# EAGLE schematic Pi-Matic.-.v0.2 (EAGLE 6.5.0)
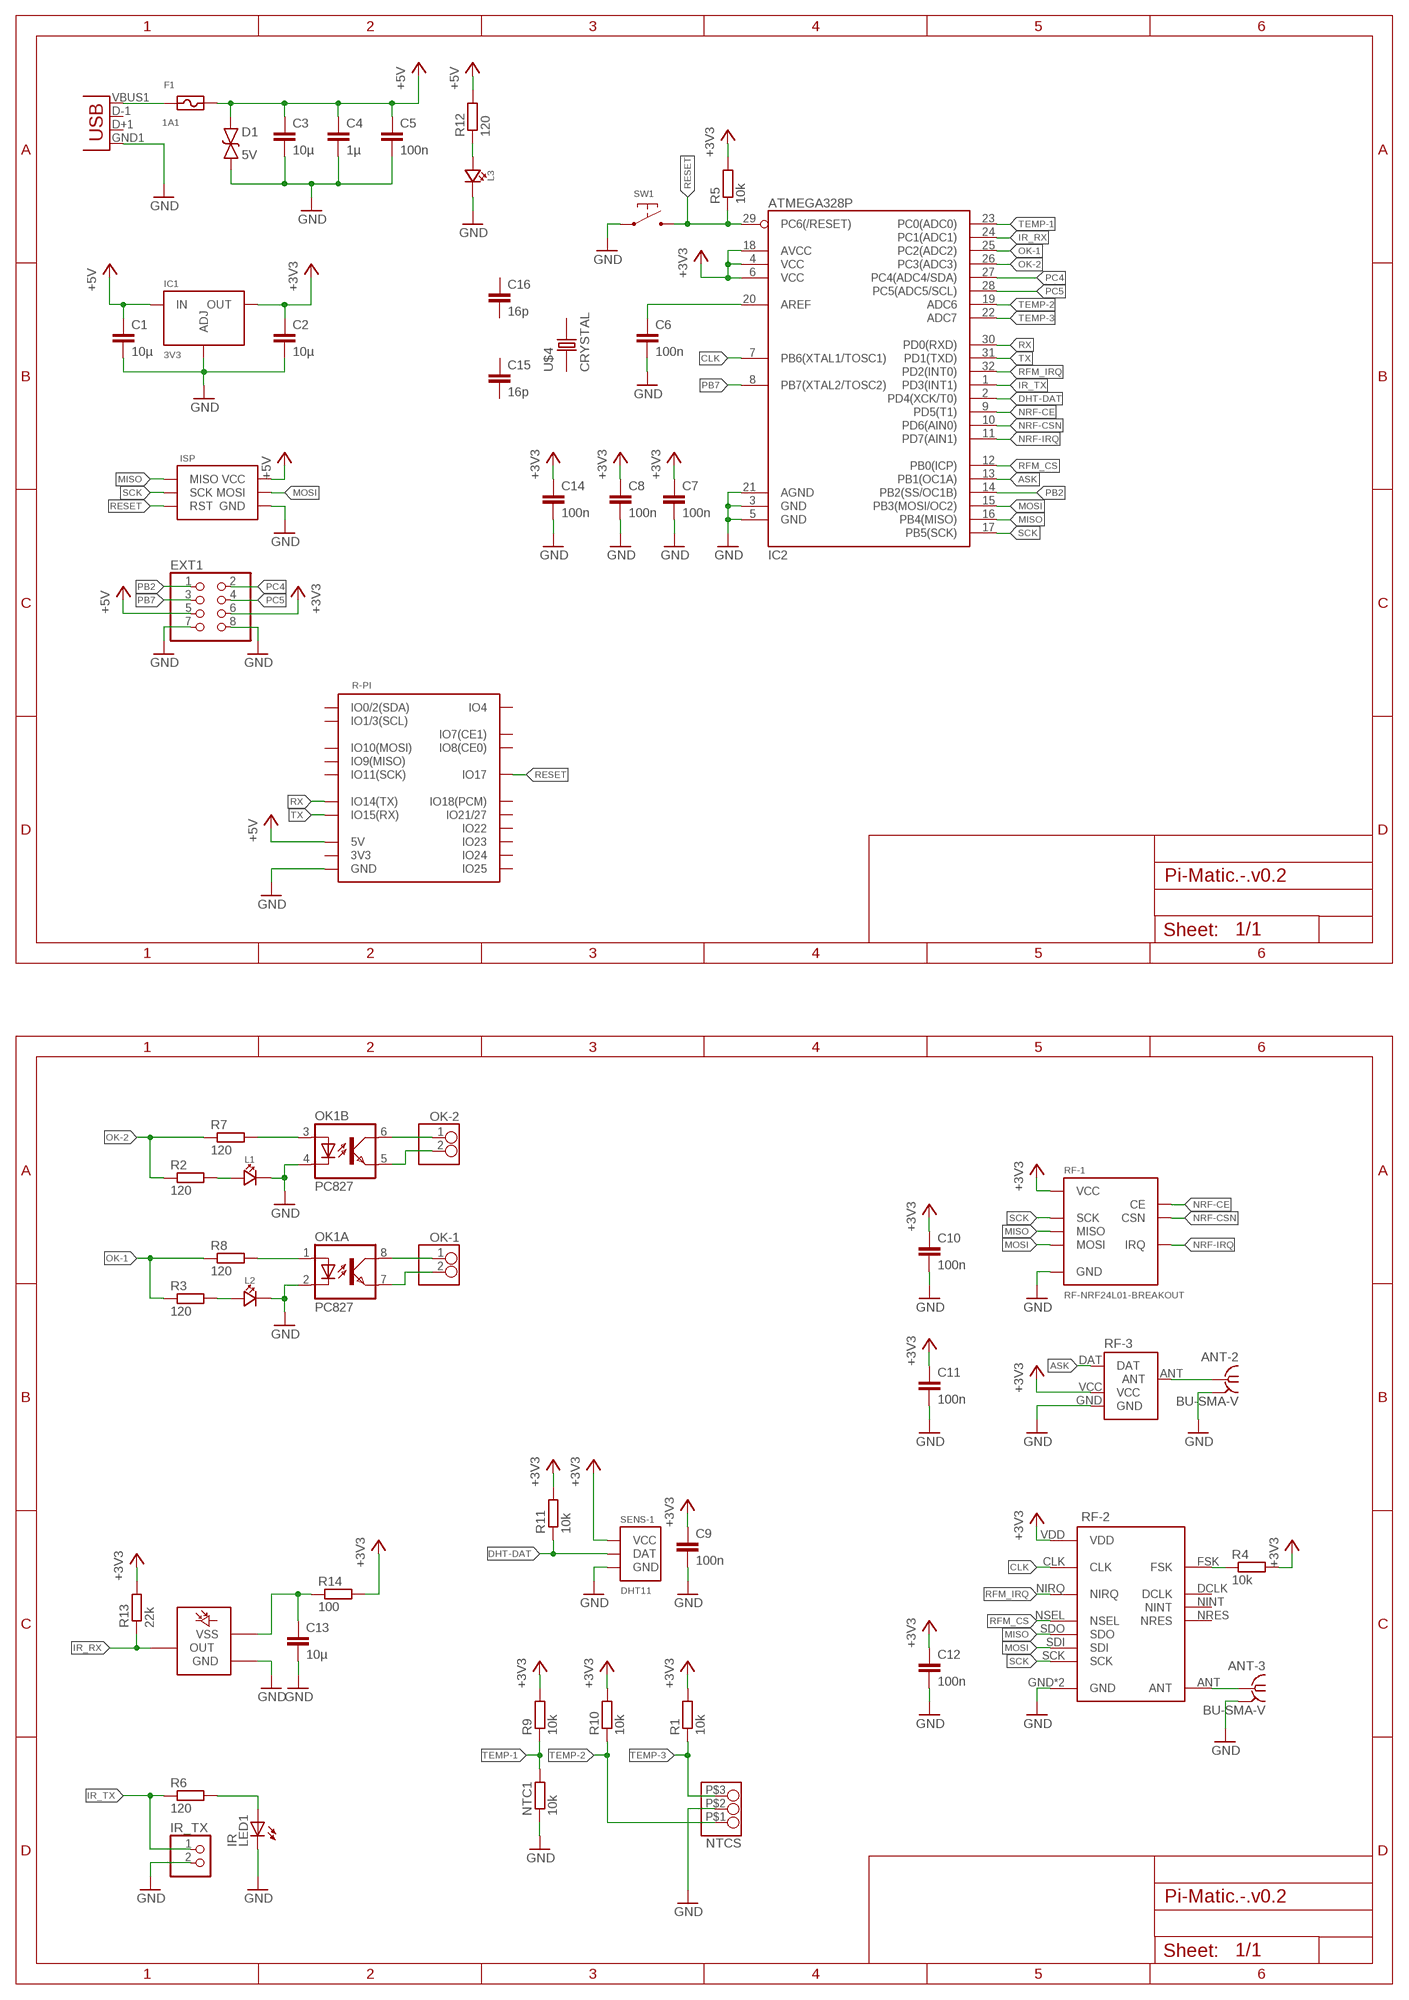
[diagram p0: schematic, sheet 1]

## Parts
ANT-2  BU-SMA-V  [BU-SMA-V]
ANT-3  BU-SMA-V  [BU-SMA-V]
C1  10µ  C-EUC0805  [C0805]
C2  10µ  C-EUC0805  [C0805]
C3  10µ  C-EUC0805  [C0805]
C4  1µ  C-EUC0805  [C0805]
C5  100n  C-EUC0603  [C0603]
C6  100n  C-EUC0603  [C0603]
C7  100n  C-EUC0603  [C0603]
C8  100n  C-EUC0603  [C0603]
C9  100n  C-EUC0603  [C0603]
C10  100n  C-EUC0603  [C0603]
C11  100n  C-EUC0603  [C0603]
C12  100n  C-EUC0603  [C0603]
C13  10µ  C-EUC0805  [C0805]
C14  100n  C-EUC0603  [C0603]
C15  16p  C-EUC0603  [C0603]
C16  16p  C-EUC0603  [C0603]
D1  5V  DIODE-TVS-BI  [R0603]
EXT1  PINHD-2X4  [2X04]
F1  1A1  FUSE1812  [SMD-1812]
IC1  3V3  REGULATOR-TLV1117SOT223  [SOT223]
IC2  ATMEGA328P  ATMEGA328_SMT  [TQFP32-08]
IR_TX  PINHD-1X2/90  [1X02/90]
ISP  ISP-6_PIN-NORMAL  [PINHEADER-100-MIL-2X6-ISP]
L1  LED0603  [CHIPLED_0603]
L2  LED0603  [CHIPLED_0603]
L3  LED0603  [CHIPLED_0603]
LED1  IR  LED5MM  [LED5MM]
NTC1  10k  R-EU_R0805  [R0805]
NTCS  GENERIC-1X3WAGO-5MM  [WAGO-5MM-3_PIN]
OK1  PC827  OPTOCOUPLER-PC827SMD  [SMD08]
OK-1  GENERIC-1X2_PINWAGO-5MM-N  [WAGO-5MM-2_PIN-1]
OK-2  GENERIC-1X2_PINWAGO-5MM-N  [WAGO-5MM-2_PIN-1]
R1  10k  R-EU_R0603  [R0603]
R2  120  R-EU_R0603  [R0603]
R3  120  R-EU_R0603  [R0603]
R4  10k  R-EU_R0603  [R0603]
R5  10k  R-EU_R0603  [R0603]
R6  120  R-EU_R0603  [R0603]
R7  120  R-EU_R0603  [R0603]
R8  120  R-EU_R0603  [R0603]
R9  10k  R-EU_R0603  [R0603]
R10  10k  R-EU_R0603  [R0603]
R11  10k  R-EU_R0603  [R0603]
R12  120  R-EU_R0603  [R0603]
R13  22k  R-EU_R0603  [R0603]
R14  100  R-EU_R0603  [R0603]
R-PI  RASPBERRY-PI  [RASPBERRY-PI]
RF-1  RF-NRF24L01-BREAKOUT  [RF-NRF2401]
RF-2  RADIO-RFM12SMD  [RADIO-RFM12-SMD]
RF-3  RADIO-QAM_TX1  [RADIO-ASK-QAM-TX1-SIP]
SENS-1  DHT11  DHT11DHT11  [SENSOR-DHT11]
SW1  SWITCH-DEFAULT_OFF-SMD-2_PIN  [SWITCH-SMD-2_PIN-DX]
U$1  IR-RECIEVERTSOP348XX  [IR-REC-3PIN]
U$3  USB  [USB-AB-MICRO-SMD_V03]
U$4  CRYSTAL  [CRYSTAL-SMD-5MM_X_3.2MM]

## Nets
+3V3: C2.1 C7.1 C8.1 C9.1 C10.1 C11.1 C12.1 C14.1 EXT1.6 IC1.2(OUT) IC1.4(OUT) IC2.4(VCC) IC2.6(VCC) IC2.18(AVCC) R1.2 R4.2 R5.2 R9.2 R10.2 R11.2 R13.2 R14.2 RF-1.P$2(VCC) RF-2.VDD RF-3.VCC SENS-1.P$1(VCC)
+5V: C1.1 C3.1 C4.1 C5.1 D1.1 EXT1.5 F1.P$2 IC1.3(IN) ISP.P$6(VCC) R12.2 R-PI.2(5V) R-PI.4(5V)
ASK: IC2.13(PB1(OC1A)) RF-3.DAT
CLK: IC2.7(PB6(XTAL1/TOSC1)) RF-2.CLK
DHT-DAT: IC2.2(PD4(XCK/T0)) R11.1 SENS-1.P$2(DAT)
GND: ANT-2.2 ANT-2.3 ANT-2.4 ANT-2.5 ANT-3.2 ANT-3.3 ANT-3.4 ANT-3.5 C1.2 C2.2 C3.2 C4.2 C5.2 C6.2 C7.2 C8.2 C9.2 C10.2 C11.2 C12.2 C13.2 C14.2 D1.2 EXT1.7 EXT1.8 IC1.1(ADJ) IC2.3(GND) IC2.5(GND) IC2.21(AGND) IR_TX.2 ISP.P$4(GND) L1.C L2.C L3.C LED1.K(C) NTC1.1 NTCS.P$2 OK1.2(A:C) OK1.4(B:C) R-PI.6(GND) R-PI.9(GND) R-PI.14(GND) R-PI.20(GND) R-PI.25(GND) RF-1.P$1(GND) RF-2.GND RF-2.GND_(GND) RF-3.GND SENS-1.P$4(GND) SW1.P$1 U$1.P$2(GND) U$3.GND1(GND)
IR_RX: IC2.24(PC1(ADC1)) R13.1 U$1.P$1(OUT)
IR_TX: IC2.1(PD3(INT1)) IR_TX.1 R6.1
MISO: IC2.16(PB4(MISO)) ISP.P$1(MISO) RF-1.P$7(MISO) RF-2.SDO
MOSI: IC2.15(PB3(MOSI/OC2)) ISP.P$5(MOSI) RF-1.P$6(MOSI) RF-2.SDI
N$1: ANT-2.1 RF-3.ANT
N$2: ANT-3.1 RF-2.ANT
N$3: LED1.A R6.2
N$4: R4.1 RF-2.FSK
N$5: OK1.1(A:A) R8.2
N$6: OK1.3(B:A) R7.2
N$7: OK1.5(B:EMIT) OK-2.2
N$8: OK1.6(B:COL) OK-2.1
N$9: OK1.8(A:COL) OK-1.1
N$10: OK1.7(A:EMIT) OK-1.2
N$11: L1.A R2.2
N$12: L2.A R3.2
N$13: F1.P$1 U$3.VBUS1(VBUS)
N$14: L3.A R12.1
N$15: C6.1 IC2.20(AREF)
N$16: C13.1 R14.1 U$1.P$3(VSS)
NRF-CE: IC2.9(PD5(T1)) RF-1.P$3(CE)
NRF-CSN: IC2.10(PD6(AIN0)) RF-1.P$4(CSN)
NRF-IRQ: IC2.11(PD7(AIN1)) RF-1.P$8(IRQ)
OK-1: IC2.25(PC2(ADC2)) R3.1 R8.1
OK-2: IC2.26(PC3(ADC3)) R2.1 R7.1
PB2: EXT1.1 IC2.14(PB2(SS/OC1B))
PB7: EXT1.3 IC2.8(PB7(XTAL2/TOSC2))
PC4: EXT1.2 IC2.27(PC4(ADC4/SDA))
PC5: EXT1.4 IC2.28(PC5(ADC5/SCL))
RESET: IC2.29(PC6(/RESET)) ISP.P$3(RST) R5.1 R-PI.11(IO17) SW1.P$2
RFM_CS: IC2.12(PB0(ICP)) RF-2.NSEL
RFM_IRQ: IC2.32(PD2(INT0)) RF-2.NIRQ
RX: IC2.30(PD0(RXD)) R-PI.8(IO14(TX))
SCK: IC2.17(PB5(SCK)) ISP.P$2(SCK) RF-1.P$5(SCK) RF-2.SCK
TEMP-1: IC2.23(PC0(ADC0)) NTC1.2 R9.1
TEMP-2: IC2.19(ADC6) NTCS.P$1 R10.1
TEMP-3: IC2.22(ADC7) NTCS.P$3 R1.1
TX: IC2.31(PD1(TXD)) R-PI.10(IO15(RX))
Unconnected: C15.1 C15.2 C16.1 C16.2 R-PI.1(3V3) R-PI.3(IO0/2(SDA)) R-PI.5(IO1/3(SCL)) R-PI.7(IO4) R-PI.12(IO18(PCM)) R-PI.13(IO21/27) R-PI.15(IO22) R-PI.16(IO23) R-PI.17(3V3) R-PI.18(IO24) R-PI.19(IO10(MOSI)) R-PI.21(IO9(MISO)) R-PI.22(IO25) R-PI.23(IO11(SCK)) R-PI.24(IO8(CE0)) R-PI.26(IO7(CE1)) RF-2.DCLK RF-2.NINT RF-2.NRES U$3.D+1(D+) U$3.D-1(D-) U$4.P$1(C1) U$4.P$2(C2)

## Library data of the parts
ANT-2 ANT-3 = con-coax:BU-SMA-V: FEMALE SMA CONNECTOR Radiall distributor RS 112-3794; OC_FARNELL: unknown; OC_NEWARK: unknown
C1-C16 = p.peter-rcl:C-EU: CAPACITOR, European symbol
D1 = p.peter-passives:DIODE-TVS-BI
EXT1 = pinhead:PINHD-2X4: PIN HEADER
F1 = p.peter-regulators:FUSE
IC1 = p.peter-regulators:REGULATOR-TLV1117
IC2 = SparkFun-DigitalIC:ATMEGA328_SMT: 32-Pin Atmega328 part Commonly used on Arduino compatible boards Available in QFP and QFN packages TQFP is IC-09069 QFN is non-stock; PROD_ID: IC-09069
IR_TX = pinhead:PINHD-1X2: PIN HEADER
ISP = p.peter-connectors:ISP-6_PIN: AVR 6 PIN ISP header Edge connector normal layout
L1-L3 = p.peter-leds:LED
LED1 = led:LED: LED OSRAM: - CHIPLED LG R971, LG N971, LY N971, LG Q971, LY Q971, LO R971, LY R971 LH N974, LH R974 LS Q976, LO Q976, LY Q976 LO Q996 - Hyper CHIPLED LW Q18S LB Q993, LB Q99A, LB R99A - SideLED LS A670, LO A670, LY A670, LG A670, LP A670 LB A673, LV A673, LT A673, LW A673 LH A674 LY A675 LS A676, LA A676, LO A676, LY A676, LW A676 LS A679, LY A679, LG A679 - Hyper Micro SIDELED® LS Y876, LA Y876, LO Y876, LY Y876 LT Y87S - SmartLED LW L88C, LW L88S LB L89C, LB L89S, LG L890 LS L89K, LO L89K, LY L89K LS L896, LA L896, LO L896, LY L896 - TOPLED LS T670, LO T670, LY T670, LG T670, LP T670 LSG T670, LSP T670, LSY T670, LOP T670, LYG T670 LG T671, LOG T671, LSG T671 LB T673, LV T673, LT T673, LW T673 LH T674 LS T676, LA T676, LO T676, LY T676, LB T676, LH T676, LSB T676, LW T676 LB T67C, LV T67C, LT T67C, LS T67K, LO T67K, LY T67K, LW E67C LS E67B, LA E67B, LO E67B, LY E67B, LB E67C, LV E67C, LT E67C LW T67C LS T679, LY T679, LG T679 LS T770, LO T770, LY T770, LG T770, LP T770 LB T773, LV T773, LT T773, LW T773 LH T774 LS E675, LA E675, LY E675, LS T675 LS T776, LA T776, LO T776, LY T776, LB T776 LHGB T686 LT T68C, LB T68C - Hyper Mini TOPLED® LB M676 - Mini TOPLED Santana® LG M470 LS M47K, LO M47K, LY M47K Source: http://www.osram.convergy.de LUXEON: - LUMILED® LXK2-PW12-R00, LXK2-PW12-S00, LXK2-PW14-U00, LXK2-PW14-V00 LXK2-PM12-R00, LXK2-PM12-S00, LXK2-PM14-U00 LXK2-PE12-Q00, LXK2-PE12-R00, LXK2-PE12-S00, LXK2-PE14-T00, LXK2-PE14-U00 LXK2-PB12-K00, LXK2-PB12-L00, LXK2-PB12-M00, LXK2-PB14-N00, LXK2-PB14-P00, LXK2-PB14-Q00 LXK2-PR12-L00, LXK2-PR12-M00, LXK2-PR14-Q00, LXK2-PR14-R00 LXK2-PD12-Q00, LXK2-PD12-R00, LXK2-PD12-S00 LXK2-PH12-R00, LXK2-PH12-S00 LXK2-PL12-P00, LXK2-PL12-Q00, LXK2-PL12-R00 Source: www.luxeon.com KINGBRIGHT: KA-3528ASYC Source: www.kingbright.com
NTC1 R1-R14 = p.peter-rcl:R-EU_: RESISTOR, European symbol
NTCS = p.peter-connectors:GENERIC-1X3
OK1 = p.peter-ics:OPTOCOUPLER-PC827: SHARP OPTO COUPLER
OK-1 OK-2 = p.peter-connectors:GENERIC-1X2_PIN
R-PI = p.peter-periphery:RASPBERRY-PI: Raspberry Pi Board <http://www.raspberrypi.org/> Jacques Lagnel V1.0 (beta) 2012 Board dimension: Forum 3D model <http://www.raspberrypi.org/forum/general-discussion/mechanical-profile-3d-models?value=3d%20model&type=1&include=1&search=1&ret=all> The GPIO Connector (P1): http://elinux.org/RPi_Low-level_peripherals
RF-1 = p.peter-periphery:RF-NRF24L01
RF-2 = p.peter-ics:RADIO-RFM12: RFM12 Funk Modul
RF-3 = p.peter-ics:RADIO-QAM_TX1
SENS-1 = p.peter-periphery:DHT11
SW1 = p.peter-passives:SWITCH-DEFAULT_OFF
U$1 = p.peter-leds:IR-RECIEVER
U$3 = p.peter-connectors:USB
U$4 = p.peter-ics:CRYSTAL